# EAGLE schematic Point-Welder-V2-Schematics (EAGLE 9.6.2)
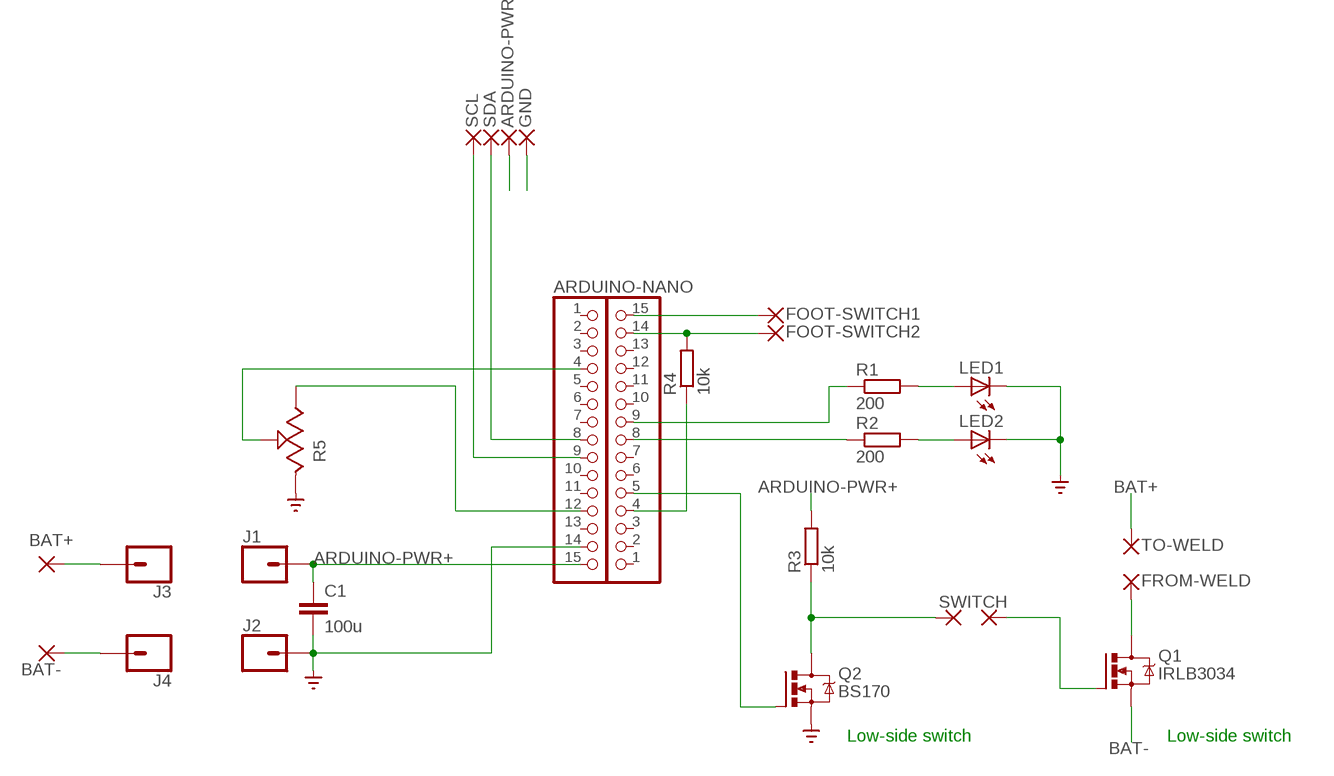
[diagram p0: schematic, sheet 1]

## Parts
ARDUINO-NANO  PINHD-1X15  [1X15]
ARDUINO-PWR  SMD2  [SMD1,27-2,54]
BAT-  SMD5  [SMD2,54-5,08]
C1  100u  C-EU025-060X050  [C025-060X050]
FOOT-SWITCH1  SMD2  [SMD1,27-2,54]
FOOT-SWITCH2  SMD2  [SMD1,27-2,54]
FROM-WELD  SMD5  [SMD2,54-5,08]
GND  SMD2  [SMD1,27-2,54]
J1  CONN_01  [1X01]
J2  CONN_01  [1X01]
J3  CONN_01  [1X01]
J4  CONN_01  [1X01]
JP1  PINHD-1X15  [1X15]
LED1  LED3MM  [LED3MM]
LED2  LED3MM  [LED3MM]
PAD3  SMD2  [SMD1,27-2,54]
PAD11  SMD5  [SMD2,54-5,08]
Q1  IRLB3034  NMOSFET__TO220  [TO220BV]
Q2  BS170  NMOSFET__TO92  [TO92]
R1  200  R-EU_0204/7  [0204/7]
R2  200  R-EU_0204/7  [0204/7]
R3  10k  R-EU_0204/7  [0204/7]
R4  10k  R-EU_0204/7  [0204/7]
R5  91A1A-B28-B15L  [91A1A-B28-B15L-ND]
SCL  SMD2  [SMD1,27-2,54]
SDA  SMD2  [SMD1,27-2,54]
SWITCH  SMD2  [SMD1,27-2,54]
TO-WELD  SMD5  [SMD2,54-5,08]

## Nets
ARDUINO-PWR+: ARDUINO-NANO.15 ARDUINO-PWR.1(P) C1.1 J1.1 R3.2
BAT+ [Positive terminal]: J3.1 PAD11.1(P) TO-WELD.1(P)
BAT- [Negative terminal]: BAT-.1(P) J4.1 Q1.S
DRIVER: JP1.5 Q2.2(G)
FOOT-SWITCH+: FOOT-SWITCH1.1(P) JP1.15
FOOT-SWITCH-: FOOT-SWITCH2.1(P) JP1.14 R4.2
GND: ARDUINO-NANO.14 C1.2 GND.1(P) J2.1 LED1.K(C) LED2.K(C) Q2.3(S) R5.1 ; supply symbol labelled SUPPLY0_GND_
N$1: Q2.1(D) R3.1 SWITCH.1(P)
N$2: LED2.A R2.2
N$3: LED1.A R1.2
N$4: ARDUINO-NANO.4 R5.2
N$5: JP1.4 R4.1
N$6: PAD3.1(P) Q1.G
N$7: JP1.9 R1.1
N$8: JP1.8 R2.1
N$10: ARDUINO-NANO.12 R5.3
N$11: ARDUINO-NANO.9 SCL.1(P)
N$12: ARDUINO-NANO.8 SDA.1(P)
N$13 [Negative terminal]: FROM-WELD.1(P) Q1.D
Unconnected: ARDUINO-NANO.1 ARDUINO-NANO.2 ARDUINO-NANO.3 ARDUINO-NANO.5 ARDUINO-NANO.6 ARDUINO-NANO.7 ARDUINO-NANO.10 ARDUINO-NANO.11 ARDUINO-NANO.13 JP1.1 JP1.2 JP1.3 JP1.6 JP1.7 JP1.10 JP1.11 JP1.12 JP1.13

## Notes on the sheet
- Low-side switch | Low-side switch

## Library data of the parts
ARDUINO-NANO JP1 = Adafruit:PINHD-1X15: PIN HEADER; OC_FARNELL: unknown
ARDUINO-PWR FOOT-SWITCH1 FOOT-SWITCH2 GND PAD3 SCL SDA SWITCH = wirepad:SMD2: SMD PAD; OC_FARNELL: unknown
BAT- FROM-WELD PAD11 TO-WELD = wirepad:SMD5: SMD PAD; OC_FARNELL: unknown
C1 = resistor:C-EU: CAPACITOR, European symbol; OC_FARNELL: unknown
J1-J4 = SparkFun-Connectors:CONN_01: Single connection point. Often used as Generic Header-pin footprint for 0.1 inch spaced/style header connections On any of the 0.1 inch spaced packages, you can populate with these: Break Away Headers - Straight <https://www.sparkfun.com/products/116> (PRT-00116) Break Away Male Headers - Right Angle <https://www.sparkfun.com/products/553> (PRT-00553) Female Headers <https://www.sparkfun.com/products/115> (PRT-00115) Break Away Headers - Machine Pin <https://www.sparkfun.com/products/117> (PRT-00117) Break Away Female Headers - Swiss Machine Pin <https://www.sparkfun.com/products/743> (PRT-00743) This device is also useful as a general connection point to wire up your design to another part of your project. Our various solder wires solder well into these plated through hole pads. Hook-Up Wire - Assortment (Stranded, 22 AWG) <https://www.sparkfun.com/products/11375> (PRT-11375) Hook-Up Wire - Assortment (Solid Core, 22 AWG) <https://www.sparkfun.com/products/11367> (PRT-11367) View the entire wire category on our website here <https://www.sparkfun.com/categories/141> Special notes: SMTSO-256-ET is a "flush mount" nut for a 4-40 screw. We mostly use this on specialty testbeds; it is a nice way to connect hardware to your PCB at an adjustable hieght. Also note, the SNAP packages are for using a snappable style connector. We sell a baggie of snaps and they are also used on two LilyPad designs: Snap Assortment - 30 pack (male and female) <https://www.sparkfun.com/products/11347> (DEV-11347) LilyPad Arduino SimpleSnap <https://www.sparkfun.com/products/10941> (DEV-10941) LilyPad SimpleSnap Protoboard <https://www.sparkfun.com/products/10940> (DEV-10940); OC_FARNELL: unknown
LED1 LED2 = Adafruit:LED: LED OSRAM: - CHIPLED LG R971, LG N971, LY N971, LG Q971, LY Q971, LO R971, LY R971 LH N974, LH R974 LS Q976, LO Q976, LY Q976 LO Q996 - Hyper CHIPLED LW Q18S LB Q993, LB Q99A, LB R99A - SideLED LS A670, LO A670, LY A670, LG A670, LP A670 LB A673, LV A673, LT A673, LW A673 LH A674 LY A675 LS A676, LA A676, LO A676, LY A676, LW A676 LS A679, LY A679, LG A679 - Hyper Micro SIDELED® LS Y876, LA Y876, LO Y876, LY Y876 LT Y87S - SmartLED LW L88C, LW L88S LB L89C, LB L89S, LG L890 LS L89K, LO L89K, LY L89K LS L896, LA L896, LO L896, LY L896 - TOPLED LS T670, LO T670, LY T670, LG T670, LP T670 LSG T670, LSP T670, LSY T670, LOP T670, LYG T670 LG T671, LOG T671, LSG T671 LB T673, LV T673, LT T673, LW T673 LH T674 LS T676, LA T676, LO T676, LY T676, LB T676, LH T676, LSB T676, LW T676 LB T67C, LV T67C, LT T67C, LS T67K, LO T67K, LY T67K, LW E67C LS E67B, LA E67B, LO E67B, LY E67B, LB E67C, LV E67C, LT E67C LW T67C LS T679, LY T679, LG T679 LS T770, LO T770, LY T770, LG T770, LP T770 LB T773, LV T773, LT T773, LW T773 LH T774 LS E675, LA E675, LY E675, LS T675 LS T776, LA T776, LO T776, LY T776, LB T776 LHGB T686 LT T68C, LB T68C - Hyper Mini TOPLED® LB M676 - Mini TOPLED Santana® LG M470 LS M47K, LO M47K, LY M47K Source: http://www.osram.convergy.de/; OC_FARNELL: unknown
Q1 = Tinkercad:NMOSFET: N-Channel MOSFET - Generic; CATEGORY: Transistor; DATASHEET: https://4donline.ihs.com/images/VipMasterIC/IC/INFN/INFN-S-A0012837606/INFN-S-A0012838563-1.pdf?hkey=6D3A4C79FDBF58556ACFDE234799DDF0; MF: INFINEON; MPN: IRLB3034PBF; OC_FARNELL: 1698299; SUB-CATEGORY: MOSFET; TYPE: N-Channel; VALUE: NMOSFET
Q2 = Tinkercad:NMOSFET: N-Channel MOSFET - Generic; CATEGORY: Transistor; OC_FARNELL: unknown; SUB-CATEGORY: MOSFET; TYPE: N-Channel; VALUE: NMOSFET
R1-R4 = resistor:R-EU_: RESISTOR, European symbol; OC_FARNELL: unknown
R5 = Potentiometer_Trimmers:91A1A-B28-B15L: POT 10K OHM 1W PLASTIC LINEAR Manufacturer's datasheet <https://www.bourns.com/docs/Product-Datasheets/91_95.pdf>; CREATED_BY: PCBLayout.com; DIGIKEY_PARTNO: 91A1A-B28-B15L-ND; MANUFACTURER: Bourns Inc.; MF: BOURNS; MPN: 91A1A-B28-B15L; OC_FARNELL: 9357769

## Module TEST
Ports: 

### Library data of the parts

## Net classes
1 Negative terminal: clearance 0.762 mm
2 Positive terminal: clearance 2.032 mm